# Altium schematic sheet Case_4pin.SchDoc
size A4
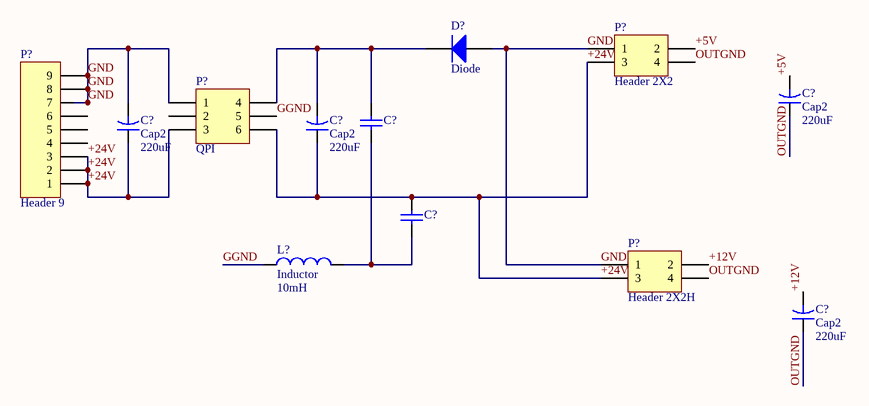
[diagram p0: Case_4pin.SchDoc]

## Parts
(Parts that share a designator on the sheet are numbered #1, #2 ... from top to bottom, then left to right.)
C?#1  Cap2  value 220uF  [CAPR5-4X5]
C?#2  Cap2  value 220uF  [CAPR5-4X5]
C?#3  Cap2  value 220uF  [CAPR5-4X5]
C?#4  (no value)  [C1206]
C?#5  (no value)  [C1206]
C?#6  Cap2  value 220uF  [CAPR5-4X5]
D?  Diode  [SMC]
L?  Inductor  value 10mH  [0402-A]
P?#1  Header 2X2  [HDR2X2]
P?#2  QPI  [HDR2X3_CEN]
P?#3  Header 9  [HDR1X9]
P?#4  Header 2X2H  [HDR2X2H]

## Nets
+5V: C?#1.2 P?#1.2
+12V: C?#6.2 P?#4.2
+24V: C?#2.1 C?#3.1 C?#5.1 P?#1.3 P?#2.3 P?#2.6 P?#3.1 P?#3.2 P?#3.3 P?#4.3
GGND: L?.1 P?#2.5
GND: C?#2.2 D?.1(A) P?#1.1 P?#2.1 P?#3.7 P?#3.8 P?#3.9 P?#4.1
OUTGND: C?#1.1 C?#6.1 P?#1.4 P?#4.4
NetC?#3_2: C?#3.2 C?#4.2 D?.2(K) P?#2.4
NetC?#4_1: C?#4.1 C?#5.2 L?.2

Not connected (* = marked no-connect by the designer): P?#2 2; P?#3 4 5 6

## Library data of the parts
C?#1-C?#3 C?#6 = Cap2: Capacitor; Published: 23-Sep-2002; PackageReference: CAPR5-4X5; Publisher: Altium Limited
C?#4 C?#5 = Cap Semi: Capacitor (Semiconductor SIM Model); Published: 8-Jun-2000; LatestRevisionDate: 17-Jul-2002; LatestRevisionNote: Re-released for DXP Platform.; PackageReference: C1206; Publisher: Altium Limited
D? = Diode: Default Diode; Published: 8-Jun-2000; LatestRevisionDate: 17-Jul-2002; LatestRevisionNote: Re-released for DXP Platform.; PackageDocument: Sep-1996; PackageReference: SMC; Publisher: Altium Limited; Code_JEDEC: DO-214-AB
L? = Inductor: Code_IEC: 1005; Published: 8-Jun-2000; LatestRevisionDate: 17-Jul-2002; LatestRevisionNote: Re-released for DXP Platform.; PackageReference: 0402-A; Publisher: Altium Limited; Code_JEITA: 0402
P?#1 = Header 2X2: Header, 2-Pin, Dual row; LatestRevisionDate: 17-Jul-2002; LatestRevisionNote: Re-released for DXP Platform.; Publisher: Altium Limited
P?#2 = Header 3X2A: Header, 3-Pin, Dual row; LatestRevisionDate: 17-Jul-2002; LatestRevisionNote: Re-released for DXP Platform.; Publisher: Altium Limited
P?#3 = Header 9: Header, 9-Pin; LatestRevisionDate: 17-Jul-2002; LatestRevisionNote: Re-released for DXP Platform.; Publisher: Altium Limited
P?#4 = Header 2X2H: Header, 2-Pin, Dual row, Right Angle; LatestRevisionDate: 17-Jul-2002; LatestRevisionNote: Re-released for DXP Platform.; Publisher: Altium Limited